# EAGLE design spider_2015-10-04-open-v2 (EAGLE 7.4.0)
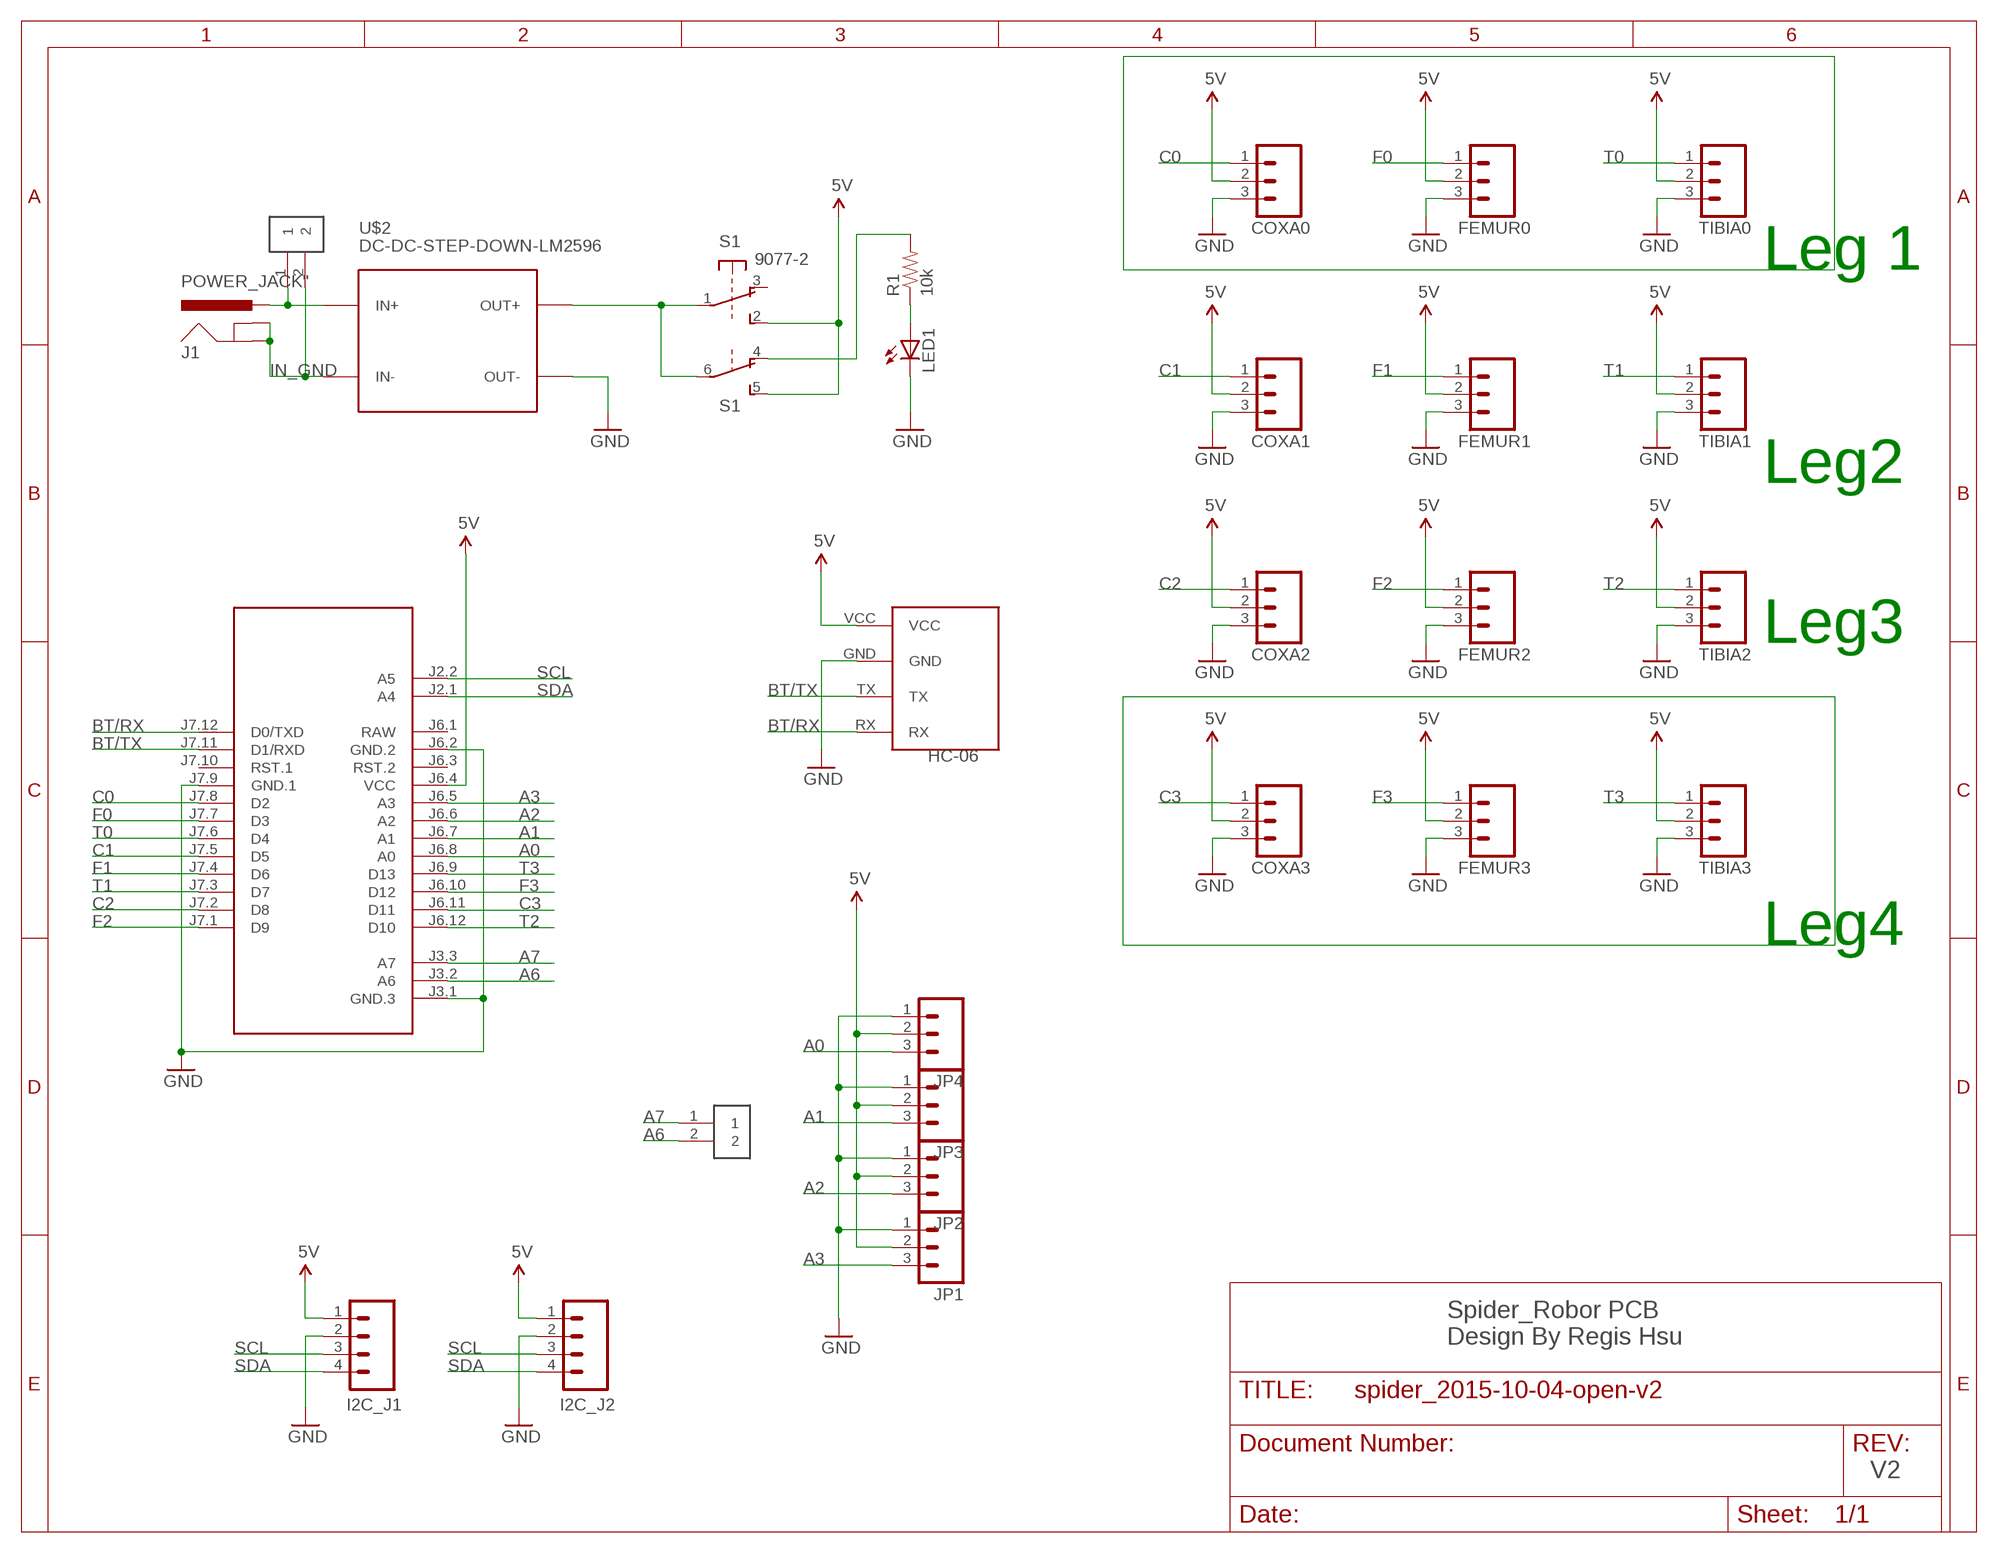
[diagram p0: schematic, sheet 1]

## Parts
COXA0  M03PTH  [1X03]
COXA1  M03PTH  [1X03]
COXA2  M03PTH  [1X03]
COXA3  M03PTH  [1X03]
FEMUR0  M03PTH  [1X03]
FEMUR1  M03PTH  [1X03]
FEMUR2  M03PTH  [1X03]
FEMUR3  M03PTH  [1X03]
HC-06  BLUETOOTH_BOARDSTANDING  [BT_BOARD_FOOTPRINT_STANDING]
I2C_J1  1X04_HEADER"  [1X04_HEADER]
I2C_J2  1X04_HEADER"  [1X04_HEADER]
J1  POWER_JACK"  [POWER_JACK]
JP1  M03PTH  [1X03]
JP2  M03PTH  [1X03]
JP3  M03PTH  [1X03]
JP4  M03PTH  [1X03]
LED1  LED3MM  [LED]
M1  ARDUINO-PRO-MINI-5.0V  [ARDUINO-PRO-MINI]
R1  10k  RESISTORPTH-1/4W  [AXIAL-0.4]
S1  9077-2  [9077-2]
TIBIA0  M03PTH  [1X03]
TIBIA1  M03PTH  [1X03]
TIBIA2  M03PTH  [1X03]
TIBIA3  M03PTH  [1X03]
U$1  1X02_HEADER  [1X02_HEADER]
U$2  DC-DC-STEP-DOWN-LM2596  [DC-DC-STEP-DOWN-LM2596]
U$3  1X02_HEADER  [1X02_HEADER]

## Nets
5V [power]: COXA0.2 COXA1.2 COXA2.2 COXA3.2 FEMUR0.2 FEMUR1.2 FEMUR2.2 FEMUR3.2 HC-06.VCC I2C_J1.1 I2C_J2.1 JP1.2 JP2.2 JP3.2 JP4.2 M1.J6.4(VCC) S1.2(1:S) S1.5(2:S) TIBIA0.2 TIBIA1.2 TIBIA2.2 TIBIA3.2
A0: JP4.3 M1.J6.8(A0)
A1: JP3.3 M1.J6.7(A1)
A2: JP2.3 M1.J6.6(A2)
A3: JP1.3 M1.J6.5(A3)
A6: M1.J3.2(A6) U$1.2
A7: M1.J3.3(A7) U$1.1
BT/RX: HC-06.RX M1.J7.12(D0/TXD)
BT/TX: HC-06.TX M1.J7.11(D1/RXD)
C0: COXA0.1 M1.J7.8(D2)
C1: COXA1.1 M1.J7.5(D5)
C2: COXA2.1 M1.J7.2(D8)
C3: COXA3.1 M1.J6.11(D11)
F0: FEMUR0.1 M1.J7.7(D3)
F1: FEMUR1.1 M1.J7.4(D6)
F2: FEMUR2.1 M1.J7.1(D9)
F3: FEMUR3.1 M1.J6.10(D12)
GND [ground]: COXA0.3 COXA1.3 COXA2.3 COXA3.3 FEMUR0.3 FEMUR1.3 FEMUR2.3 FEMUR3.3 HC-06.GND I2C_J1.2 I2C_J2.2 JP1.1 JP2.1 JP3.1 JP4.1 LED1.K(C) M1.J3.1(GND.3) M1.J6.2(GND.2) M1.J7.9(GND.1) TIBIA0.3 TIBIA1.3 TIBIA2.3 TIBIA3.3 U$2.OUT-
IN_GND [ground]: J1.GND J1.GNDBREAK U$2.IN- U$3.2
N$1 [power]: J1.PWR U$2.IN+ U$3.1
N$3 [power]: S1.1(1:P) S1.6(2:P) U$2.OUT+
N$4: R1.P$2 S1.4(2:O)
N$5: LED1.A R1.P$1
SCL: I2C_J1.3 I2C_J2.3 M1.J2.2(A5)
SDA: I2C_J1.4 I2C_J2.4 M1.J2.1(A4)
T0: M1.J7.6(D4) TIBIA0.1
T1: M1.J7.3(D7) TIBIA1.1
T2: M1.J6.12(D10) TIBIA2.1
T3: M1.J6.9(D13) TIBIA3.1
Unconnected: M1.J6.3(RST.2) M1.J7.10(RST.1) S1.3(1:O)

## Notes on the sheet
- Leg 1
- Leg2
- Leg3
- Leg4
- Spider_Robor PCB 
  Design By Regis Hsu
- V2

## Power pins joined to a net without a drawn wire
RAW: M1.J6.1(RAW)

## Library data of the parts
COXA0 COXA1-COXA3 FEMUR0 FEMUR1-FEMUR3 JP1-JP4 TIBIA0 TIBIA1-TIBIA3 = regis_spider_lib:M03: Header 3 Standard 3-pin 0.1" header. Use with straight break away headers (SKU : PRT-00116), right angle break away headers (PRT-00553), swiss pins (PRT-00743), machine pins (PRT-00117), and female headers (PRT-00115). Molex polarized connector foot print use with SKU : PRT-08232 with associated crimp pins and housings.
HC-06 = regis_spider_lib:BLUETOOTH_BOARD: Bluetooth Board V1.05
I2C_J1 I2C_J2 = regis_spider_lib:1X04_HEADER: Header 4 Standard 4-pin 0.1" header. Use with straight break away headers (SKU : PRT-00116), right angle break away headers (PRT-00553), swiss pins (PRT-00743), machine pins (PRT-00117), and female headers (PRT-00115). Molex polarized connector foot print use with SKU : PRT-08231 with associated crimp pins and housings.
J1 = regis_spider_lib:POWER_JACK: Power Jack This is the standard 5.5mm barrel jack for power. The PTH is the most common, proven, reliable, footprint. All others are experimental. The Slot footprint only works if the mill layer is transmitted to the PCB fab house so be warned. Spark Fun Electronics SKU : PRT-00119. Mating wall wart : TOL-00298 (and others)
LED1 = regis_spider_lib:LED: LED OSRAM: - CHIPLED LG R971, LG N971, LY N971, LG Q971, LY Q971, LO R971, LY R971 LH N974, LH R974 LS Q976, LO Q976, LY Q976 LO Q996 - Hyper CHIPLED LW Q18S LB Q993, LB Q99A, LB R99A - SideLED LS A670, LO A670, LY A670, LG A670, LP A670 LB A673, LV A673, LT A673, LW A673 LH A674 LY A675 LS A676, LA A676, LO A676, LY A676, LW A676 LS A679, LY A679, LG A679 - Hyper Micro SIDELED® LS Y876, LA Y876, LO Y876, LY Y876 LT Y87S - SmartLED LW L88C, LW L88S LB L89C, LB L89S, LG L890 LS L89K, LO L89K, LY L89K LS L896, LA L896, LO L896, LY L896 - TOPLED LS T670, LO T670, LY T670, LG T670, LP T670 LSG T670, LSP T670, LSY T670, LOP T670, LYG T670 LG T671, LOG T671, LSG T671 LB T673, LV T673, LT T673, LW T673 LH T674 LS T676, LA T676, LO T676, LY T676, LB T676, LH T676, LSB T676, LW T676 LB T67C, LV T67C, LT T67C, LS T67K, LO T67K, LY T67K, LW E67C LS E67B, LA E67B, LO E67B, LY E67B, LB E67C, LV E67C, LT E67C LW T67C LS T679, LY T679, LG T679 LS T770, LO T770, LY T770, LG T770, LP T770 LB T773, LV T773, LT T773, LW T773 LH T774 LS E675, LA E675, LY E675, LS T675 LS T776, LA T776, LO T776, LY T776, LB T776 LHGB T686 LT T68C, LB T68C - Hyper Mini TOPLED® LB M676 - Mini TOPLED Santana® LG M470 LS M47K, LO M47K, LY M47K Source: http://www.osram.convergy.de LUXEON: - LUMILED® LXK2-PW12-R00, LXK2-PW12-S00, LXK2-PW14-U00, LXK2-PW14-V00 LXK2-PM12-R00, LXK2-PM12-S00, LXK2-PM14-U00 LXK2-PE12-Q00, LXK2-PE12-R00, LXK2-PE12-S00, LXK2-PE14-T00, LXK2-PE14-U00 LXK2-PB12-K00, LXK2-PB12-L00, LXK2-PB12-M00, LXK2-PB14-N00, LXK2-PB14-P00, LXK2-PB14-Q00 LXK2-PR12-L00, LXK2-PR12-M00, LXK2-PR14-Q00, LXK2-PR14-R00 LXK2-PD12-Q00, LXK2-PD12-R00, LXK2-PD12-S00 LXK2-PH12-R00, LXK2-PH12-S00 LXK2-PL12-P00, LXK2-PL12-Q00, LXK2-PL12-R00 Source: www.luxeon.com KINGBRIGHT: KA-3528ASYC Source: www.kingbright.com
M1 = regis_spider_lib:ARDUINO-PRO-MINI-*: Arduino Pro Mini
R1 = regis_spider_lib:RESISTOR: Resistor Basic schematic elements and footprints for 0603, 1206, and PTH resistors.
S1 = regis_spider_lib:9077-2: MARQUARDT SWITCH 9077.0200 Distributor: Buerklin <https://www.buerklin.com/default.asp?event=ShowArtikel%2812G2822%29&l=d&jump=ArtNr_12G2822>
U$1 U$3 = regis_spider_lib:1X02_HEADER
U$2 = regis_spider_lib:DC-DC-STEP-DOWN-LM2596: DC/DC Step-Down Regulator based on LM2596-ADJ chip

## Net classes
0 default: width 0.508 mm
1 ground: width 0.254 mm
2 power: width 0.914 mm

## Board
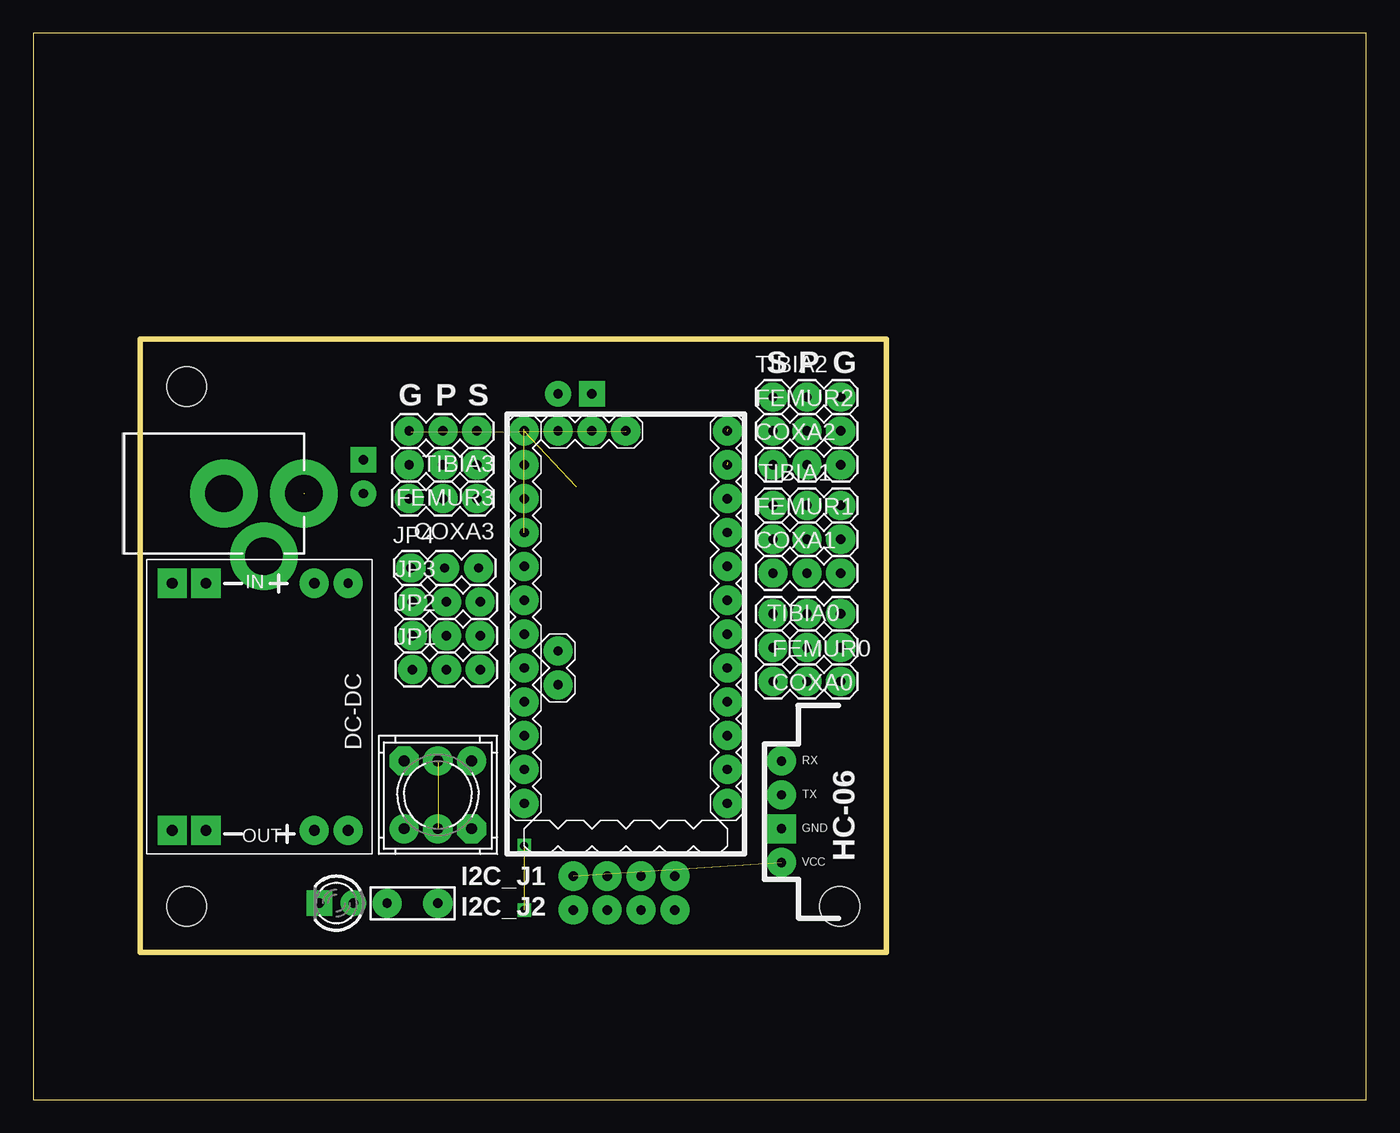
[diagram p1: board, top side]
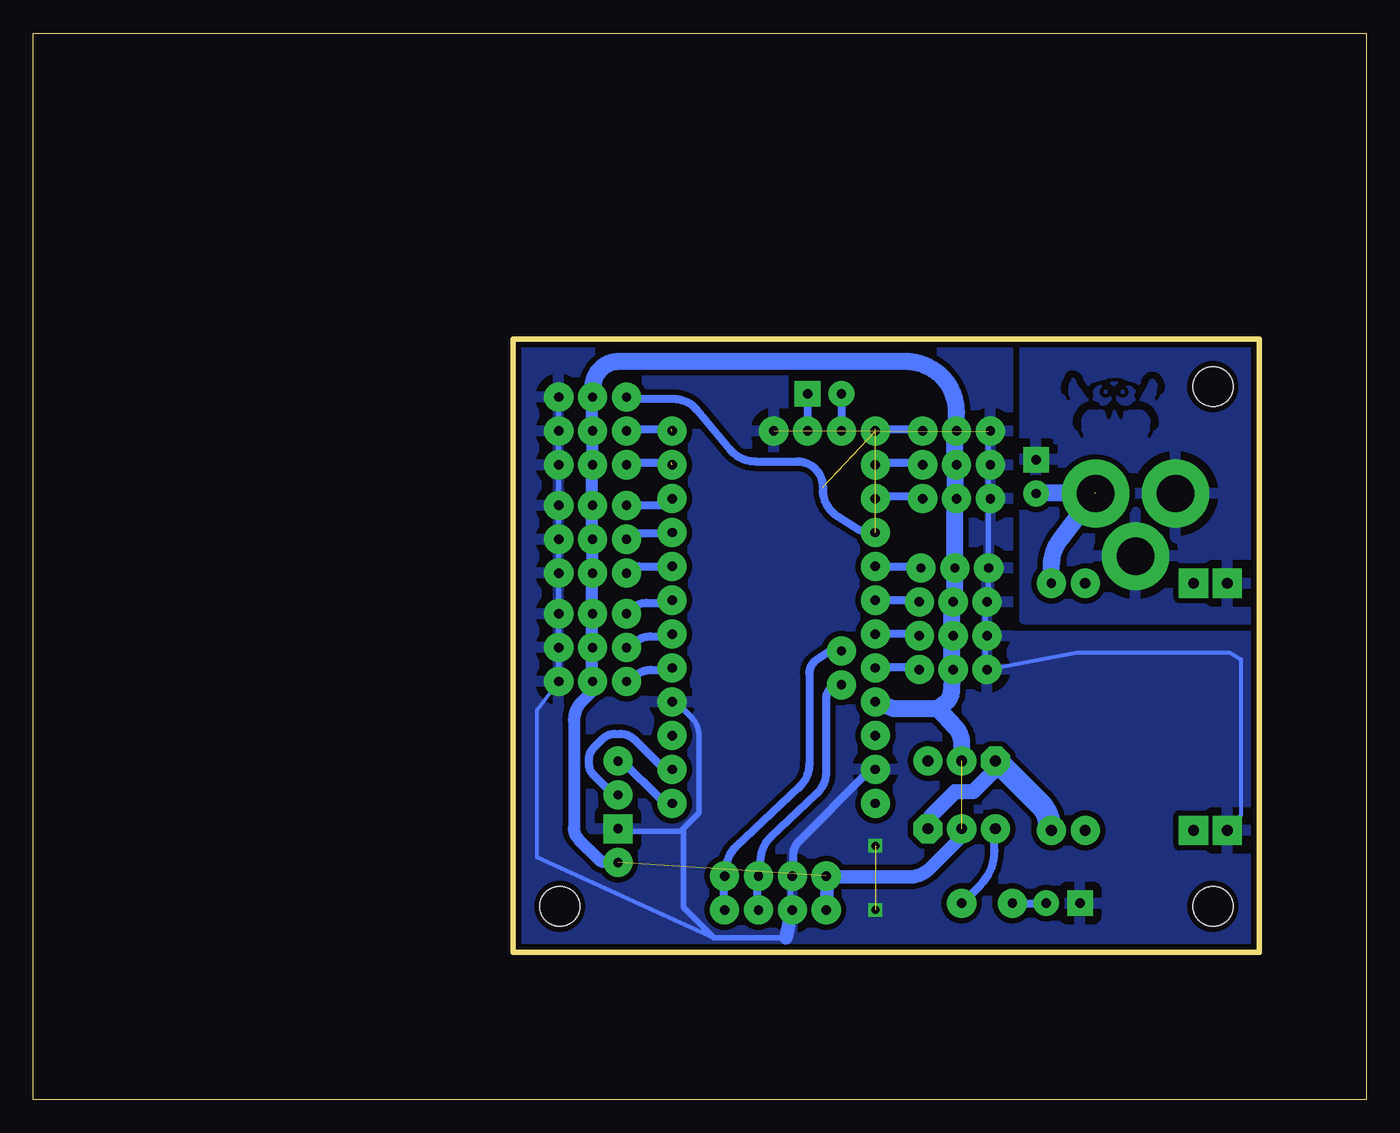
[diagram p2: board, bottom side, seen from below]

Size 100 x 80 mm. Coordinates in mm from the lower left corner, seen from the top.
Outline: 100,0 100,80 0,80 0,0 100,0
Outline: 8.01,57.05 8.01,11.06 64,11.06 64,57.05 8.01,57.05
Copper layers (1*16): Top 0.035mm / dielectric 1.5mm / Bottom 0.035mm
Design rules "default *": minimum track width 16mil, minimum drill 24mil, track to track 16mil, track to pad 24mil, pad to pad 10mil, via to via 18mil, smd to smd 8mil, copper to edge 16mil, drill to drill 8mil, minimum pad ring 10mil, minimum via ring 8mil, stop-mask expansion 4mil, vias tented up to drill 0mil, thermal gap 26mil
Holes 3 mm at 11.5,53.5 11.5,14.5 60.5,14.5
bRestrict: area 18,52.8 to 18.6,53.4; area 19.3,52.8 to 19.9,53.4; area 17.1,51.9 to 18.9,53.7; area 18.9,51.9 to 20.7,53.7; 27 lines

### Footprints (pad centres in the part's own frame; a part is rotated, then mirrored left to right if it is on the bottom)
1X03 = drill 0.7 pad 2.184: 1 0,0; 2 2.54,0; 3 5.08,0
BT_BOARD_FOOTPRINT_STANDING = drill 0.7 pad 2.184 square: GND -3.81,-1.27 | drill 0.7 pad 2.184: RX -3.81,3.81; TX -3.81,1.27; VCC -3.81,-3.81
1X04_HEADER = drill 0.7 pad 2.184: 1 0,0; 2 2.54,0; 3 5.08,0; 4 7.62,0
POWER_JACK = drill 2.8 pad 5.08: GND 0,7.7; GNDBREAK 4.7,10.7; PWR 0,13.7
LED = drill 0.7 pad 1.93: A -1.27,0 | drill 0.7 pad 1.93 square: K 1.27,0
ARDUINO-PRO-MINI = drill 0.7 pad 2.184: J2.1 -1.27,5.08; J2.2 -3.81,5.08; J3.1 15.24,0; J3.2 15.24,2.54; J3.3 15.24,5.08; J6.1 -12.7,7.62; J6.2 -10.16,7.62; J6.3 -7.62,7.62; J6.4 -5.08,7.62; J6.5 -2.54,7.62; J6.6 0,7.62; J6.7 2.54,7.62; J6.8 5.08,7.62; J6.9 7.62,7.62; J6.10 10.16,7.62; J6.11 12.7,7.62; J6.12 15.24,7.62; J7.1 15.24,-7.62; J7.2 12.7,-7.62; J7.3 10.16,-7.62; J7.4 7.62,-7.62; J7.5 5.08,-7.62; J7.6 2.54,-7.62; J7.7 0,-7.62; J7.8 -2.54,-7.62; J7.9 -5.08,-7.62; J7.10 -7.62,-7.62; J7.11 -10.16,-7.62; J7.12 -12.7,-7.62
AXIAL-0.4 = drill 0.7 pad 2.184: P$1 -1.905,0; P$2 1.905,0
9077-2 = drill 0.813 pad 2.184 octagon: 1 -2.54,2.54; 6 2.54,-2.54 | drill 0.813 pad 2.184: 2 0,2.54; 3 2.54,2.54; 4 -2.54,-2.54; 5 0,-2.54
1X02_HEADER = drill 0.7 pad 1.93: 1 -1.27,0 | drill 0.7 pad 1.93 square: 2 1.27,0
DC-DC-STEP-DOWN-LM2596 = drill 0.7 pad 2.184: IN+ -9.271,6.604 | drill 0.8 pad 2.184 square: IN- -9.271,-6.604; OUT- 9.271,-6.604; P$2 -9.271,-4.064; P$4 9.271,-4.064 | drill 0.8 pad 2.184: OUT+ 9.271,6.604; P$1 -9.271,4.064; P$3 9.271,4.064

### Placement (x,y rotation side)
COXA0  55.5,31.37 0 top
COXA1  55.5,39.5 0 top
COXA2  55.5,47.62 0 top
COXA3  33.27,45.09 180 top
FEMUR0  55.5,33.91 0 top
FEMUR1  55.5,42.04 0 top
FEMUR2  55.5,50.16 0 top
FEMUR3  33.27,47.62 180 top
HC-06  59.94,21.59 0 top
I2C_J1  40.51,16.76 0 top
I2C_J2  40.51,14.22 0 top
J1  6.6,45.47 270 top
JP1  28.45,32.26 0 top
JP2  28.45,34.8 0 top
JP3  28.45,37.34 0 top
JP4  28.32,39.88 0 top
LED1  22.73,14.73 180 top
M1  44.45,34.92 90 top
R1  28.45,14.73 0 top
S1  30.35,22.86 0 top
TIBIA0  55.5,36.45 0 top
TIBIA1  55.5,44.58 0 top
TIBIA2  55.5,52.7 0 top
TIBIA3  33.27,50.16 180 top
U$1  40.64,52.96 0 top
U$2  17.02,29.46 270 top
U$3  24.77,46.74 90 top

### Tracks (layer width: path | path; a pad name or v marks a point on that pad's centre or on a via)
5V  (2 unrouted)
  Bottom 0.914: 30.86,45.26 COXA3.2 30.86,44.81 | 30.86,47.55 FEMUR3.2 30.86,48.01 | 30.86,50.06 TIBIA3.2 | 31.09,34.75 JP2.2 31.09,35.2 | 31.09,32.69 JP1.2 | 31.09,37.26 JP3.2 30.86,37.72 | 40.46,14.4 I2C_J2.1 | 40.46,16.69 I2C_J1.1 40.01,16.69 | 30.4,19.66 30.4,20.12 S1.5 | HC-06.VCC 56.24,17.83 57.19,17.83 arc45 57.51,17.96 59.11,19.57 arc45 59.44,20.34 59.44,28.5 arc45 58.9,29.8 58.06,30.63 58.06,31.32 COXA0.2 58.06,31.77 58.06,33.83 FEMUR0.2 58.06,34.29 58.06,36.35 TIBIA0.2 58.06,36.8 58.06,39.09 COXA1.2 58.06,39.55 58.06,41.83 FEMUR1.2 58.06,42.29 58.06,44.58 TIBIA1.2 58.06,44.81 58.06,47.32 COXA2.2 58.06,47.78 58.06,50.06 FEMUR2.2 58.06,50.52 58.06,52.58 TIBIA2.2 58.29,53.03
  Bottom 1.016: 40.46,16.69 40.46,14.4 | 40.01,16.69 34.35,16.69 arc-45 32.69,17.38 30.4,19.66
  Bottom 1.27: 30.86,47.55 30.86,45.26 | 30.86,48.01 30.86,50.06 | 31.09,32.69 31.09,34.75 | 31.09,35.2 31.09,37.26 | 30.86,37.72 JP4.2 30.86,44.81 | M1.J6.4 35.43,29.34 32.13,29.34 | 32.13,29.34 30.82,27.93 arc43 30.35,26.75 S1.2 | JP1.2 31.11,30.99 31.11,30.7 arc53 31.6,29.74 32.13,29.34
A0
  Bottom 0.508: 33.6,40.01 JP4.3
  Bottom 0.61: M1.J6.8 33.6,40.01
A1
  Bottom 0.508: 33.6,37.49 JP3.3 | 36.8,37.49 M1.J6.7
  Bottom 0.61: 36.8,37.49 33.6,37.49
A2
  Bottom 0.508: 33.6,34.98 JP2.3 | 36.8,34.98 M1.J6.6
  Bottom 0.61: 36.8,34.98 33.6,34.98
A3
  Bottom 0.508: 33.6,32.46 JP1.3 | 36.8,32.46 M1.J6.5
  Bottom 0.61: 36.8,32.46 33.6,32.46
A6
  Bottom 0.61: U$1.2 M1.J3.2
A7
  Bottom 0.61: U$1.1 M1.J3.3
BT/RX
  Bottom 0.508: 52.81,22.4 52.12,22.4 M1.J7.12 | 56.01,25.6 HC-06.RX
  Bottom 0.61: 56.01,25.6 52.81,22.4
BT/TX
  Bottom 0.508: 52.81,24.92 52.12,24.92 M1.J7.11 | HC-06.TX 56.46,22.86
  Bottom 0.61: 52.81,24.92 54.91,27.02 arc-45 55.91,27.43 56.4,27.43 arc-45 57.29,27.06 57.98,26.37 arc-45 58.29,25.62 58.29,25.1 arc-45 58,24.4 56.46,22.86
C0
  Bottom 0.508: 52.12,32.23 M1.J7.8 | 55.32,31.32 COXA0.1
  Bottom 0.61: 55.32,31.32 54.92,31.72 arc45 53.68,32.23 52.12,32.23
C1
  Bottom 0.508: 55.32,39.55 COXA1.1
  Bottom 0.61: 55.32,39.55 55.06,39.8 arc45 54.58,40.01 M1.J7.5
C2  (1 unrouted)
  Bottom 0.508: 55.32,47.78 COXA2.1
  Bottom 0.61: 55.32,47.78 52.12,47.78
C3  (1 unrouted)
  Bottom 0.508: 33.38,45.26 COXA3.1
  Bottom 0.61: 36.8,45.26 33.38,45.26
F0
  Bottom 0.508: 52.12,34.75 M1.J7.7 | 55.32,33.83 FEMUR0.1
  Bottom 0.61: 55.32,33.83 54.89,34.27 arc45 53.73,34.75 52.12,34.75
F1
  Bottom 0.508: 54.86,42.52 55.32,42.06 FEMUR1.1 | 52.12,42.52 M1.J7.4
  Bottom 0.61: 54.86,42.52 52.12,42.52
F2  (1 unrouted)
  Bottom 0.508: 55.32,50.29 FEMUR2.1
  Bottom 0.61: 55.32,50.29 52.12,50.29
F3  (1 unrouted)
  Bottom 0.508: 33.38,47.78 FEMUR3.1
  Bottom 0.61: 36.8,47.78 33.38,47.78
GND  (via drill 0.6)  (2 unrouted)
  Bottom 0.305: COXA0.3 62.23,29.21 62.23,18.19 48.92,12.12 | JP1.1 21.72,33.53 10.29,33.53 9.4,33.02 9.4,21.34 U$2.OUT-
  Bottom 0.406: 51.32,20.23 50.06,21.49 50.06,27.28 arc-45 50.65,28.71 51.89,29.95 M1.J7.9 | 51.32,20.23 51.44,20.12 56.01,20.12 HC-06.GND | 37.72,24.23 37.49,24.23 | 37.03,24.69 M1.J6.2 | 42.98,16.92 I2C_J1.2 43.2,16.69 43.2,14.4 I2C_J2.2 43.2,14.17 43.2,13.72 | 43.54,12.12 48.92,12.12 51.21,14.4 51.21,20.12 51.32,20.23 | COXA0.3 FEMUR0.3 TIBIA0.3 COXA1.3 FEMUR1.3 TIBIA1.3 COXA2.3 FEMUR2.3 TIBIA2.3 60.58,52.81 | 28.57,32.69 28.57,34.75 JP2.1 28.57,34.98 28.57,37.26 JP3.1 28.35,37.49 28.35,39.78 JP4.1 28.35,40.01 28.35,45.03 COXA3.3 28.35,45.26 28.35,47.55 FEMUR3.3 28.35,47.78 28.35,50.06 TIBIA3.3 28.12,50.29 | 28.57,32.69 28.57,32.46 JP1.1 28.57,32.69 | 28.57,32.69 28.47,32.69
  Bottom 0.61: 37.49,24.23 37.03,24.69 | 42.98,16.92 42.98,18.3 arc45 42.5,19.45 37.72,24.23
  Bottom 1.016: 43.2,13.72 43.54,12.12
  other vias: 36.83,19.05 36.83,14.22
  pour Bottom: 26.92,60.96 26.92,34.8 6.35,34.8 6.35,7.62 64.77,7.62 64.77,60.96
IN_GND
  pour Bottom: 6.35,60.96 25.65,60.96 25.65,36.07 6.35,36.07
N$1  (1 unrouted)
  Bottom 1.27: 20.34,45.49 24.77,45.49 U$3.1 | U$2.IN+ 23.62,40 arc38 22.92,42.06 J1.PWR
N$2
  Bottom 1.27: 30.73,50.29 30.73,51.55 arc-90 34.55,55.37 | 34.55,55.37 56.07,55.37 | 56.07,55.37 arc-90 58.04,53.4 58.04,52.83 | 34.55,55.37 56.07,55.37
N$3
  Bottom 0.914: 27.66,25.38 S1.1 27.66,24.92 | 32.69,21.26 32.69,20.34 S1.6
  Bottom 1.143: 32.69,21.26 30.86,23.09 29.49,23.09 27.66,24.92
  Bottom 1.676: 27.66,25.38 24.47,22.19 arc45 23.77,20.5 23.77,20.34 U$2.OUT+
N$4
  Bottom 0.508: 27.89,20.12 S1.4 | 30.18,14.86 R1.P$2
  Bottom 0.61: 30.18,14.86 28.96,16.07 arc-45 27.89,18.66 27.89,20.12
N$5
  Bottom 0.61: R1.P$1 LED1.A
N$6
  pour Bottom: 10.16,32.64 25.78,32.64 25.78,26.54 10.16,26.54
N$7
  pour Bottom: 42.55,47.12 50.55,47.12 50.55,24.89 42.55,24.89
N$8
  pour Bottom: 14.48,55.63 23.37,55.63 23.37,49.28 14.48,49.28
SCL
  Bottom 0.508: 45.72,14.4 I2C_J2.3 | 45.72,16.69 I2C_J1.3 45.49,16.92
  Bottom 0.61: 45.72,16.69 45.72,14.4 | M1.J2.2 39.81,31.02 arc-77 40.51,30.14 40.51,24.61 arc47 41.23,22.95 44.7,19.66 arc-40 45.44,18.17 I2C_J1.3
SDA
  Bottom 0.508: 48.23,14.4 I2C_J2.4 | 48.23,16.69 I2C_J1.4 48.01,16.92 | 39.55,33.6 M1.J2.1
  Bottom 0.61: 48.23,16.69 48.23,14.4 | 39.55,33.6 40.39,33.53 41.23,32.99 arc-58 41.78,31.98 41.78,25.18 arc47 42.55,23.41 47.29,18.97 arc-38 48,17.62 I2C_J1.4
T0
  Bottom 0.508: 52.12,37.26 M1.J7.6 | 55.32,36.58 TIBIA0.1
  Bottom 0.61: 55.32,36.58 55.07,36.83 arc45 54.02,37.26 52.12,37.26
T1
  Bottom 0.508: M1.J7.3 52.58,44.58
  Bottom 0.61: 52.58,44.58 TIBIA1.1
T2  (1 unrouted)
  Bottom 0.508: 55.32,52.58 TIBIA2.1
  Bottom 0.61: 37.03,42.75 38.02,42.75 39.68,43.78 arc58 40.77,45.72 40.77,45.97 arc-90 42.68,47.88 45.82,47.88 arc50 47.74,48.78 50.21,51.74 arc-50 51.99,52.58 55.32,52.58
T3  (1 unrouted)
  Bottom 0.508: 33.38,50.29 TIBIA3.1
  Bottom 0.61: 36.8,50.29 33.38,50.29

### Text on the board
tPlace: G | P | S | S | P | G
bRestrict: Spider / Robot 2.0 | Regis Hsu / 2015-09